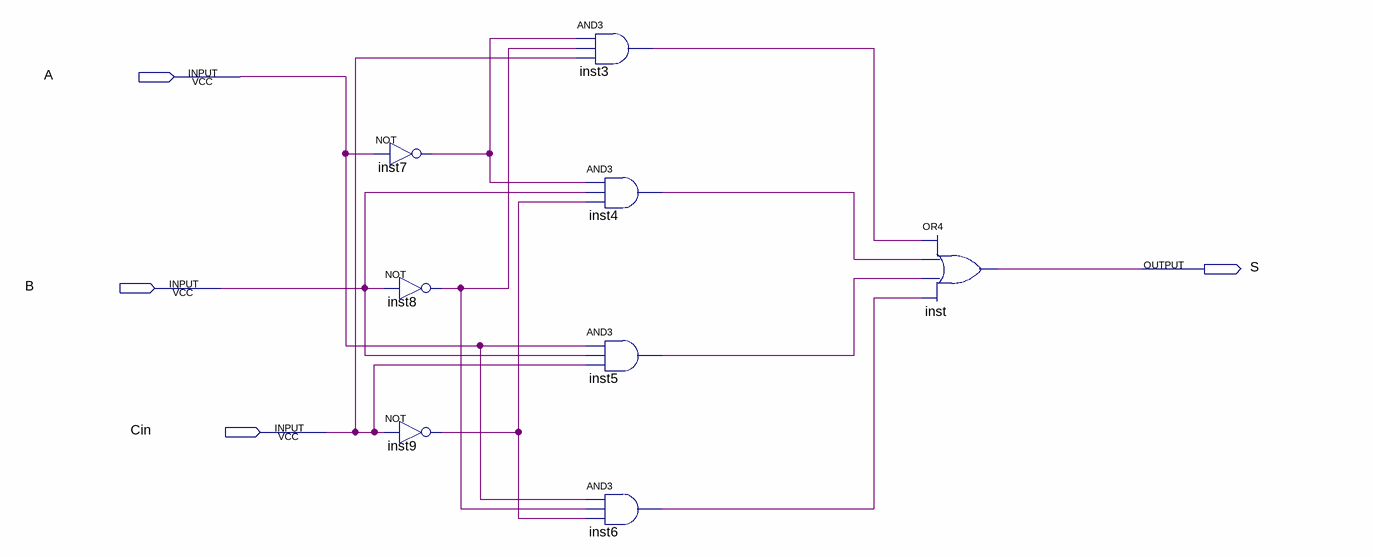
[diagram p0: schematic sheet]
// Quartus schematic B.bdf as structural Verilog: 8 symbols, 4 pins
module B (
  input  A,
  input  B,
  input  Cin,
  output S
);

  wire inst3_out, inst4_out, inst5_out, inst6_out, inst7_out, inst8_out, inst9_out;

  not inst7 (inst7_out, A);
  not inst8 (inst8_out, B);
  not inst9 (inst9_out, Cin);
  and inst3 (inst3_out, inst7_out, inst8_out, Cin);
  and inst4 (inst4_out, inst7_out, B, inst9_out);
  and inst5 (inst5_out, A, B, Cin);
  and inst6 (inst6_out, A, inst8_out, inst9_out);
  or inst (S, inst3_out, inst4_out, inst5_out, inst6_out);
endmodule
